# EAGLE schematic Voltage Divider (EAGLE 8.2.1)
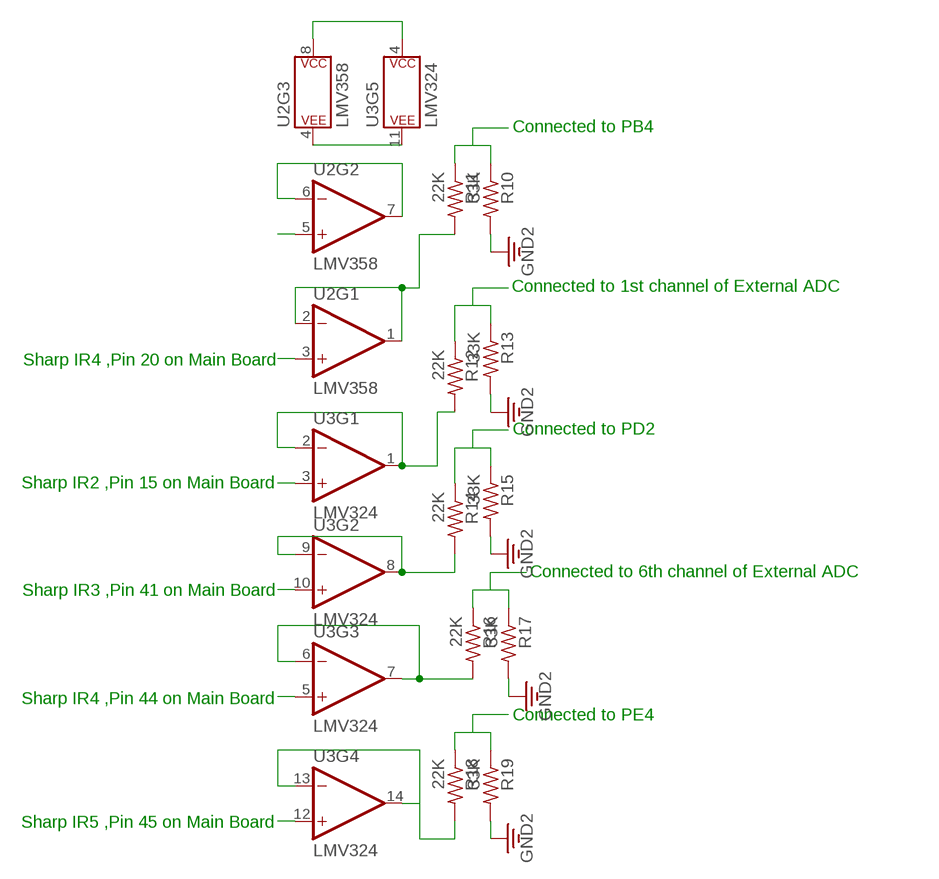
[diagram p0: schematic, sheet 1]

## Parts
R10  33K  R-US_M1206  [M1206]
R11  22K  R-US_M1206  [M1206]
R12  22K  R-US_M1206  [M1206]
R13  33K  R-US_M1206  [M1206]
R14  22K  R-US_M1206  [M1206]
R15  33K  R-US_M1206  [M1206]
R16  22K  R-US_M1206  [M1206]
R17  33K  R-US_M1206  [M1206]
R18  22K  R-US_M1206  [M1206]
R19  33K  R-US_M1206  [M1206]
U2  LMV358  LMV358SOIC  [SO08]
U3  LMV324  [SO14]

## Nets
5V1 [5V1]: U2.8(P$V+) U3.4(P$V+)
11: U2.3(+IN)
15: U3.3(+IN)
41: U3.10(+IN)
44: U3.5(+IN)
45: U3.12(+IN)
EX1: R12.1 R13.1
EX6: R16.1 R17.1
GND [5V1]: R10.2 R13.2 R15.2 R17.2 R19.2 U2.4(P$V-) U3.11(P$V-)
N1: R11.2 U2.1(OUT) U2.2(-IN)
N2: R12.2 U3.1(OUT) U3.2(-IN)
N3: R14.2 U3.8(OUT) U3.9(-IN)
N4: R16.2 U3.6(-IN) U3.7(OUT)
N5: R18.2 U3.13(-IN) U3.14(OUT)
N$2: U2.6(-IN) U2.7(OUT)
NC: U2.5(+IN)
PB4: R10.1 R11.1
PD2: R14.1 R15.1
PE4: R18.1 R19.1

## Notes on the sheet
- Connected to PB4
- Connected to 1st channel of External ADC
- Sharp IR4 ,Pin 20 on Main Board
- Connected to PD2
- Sharp IR2 ,Pin 15 on Main Board
- Connected to 6th channel of External ADC
- Sharp IR3 ,Pin 41 on Main Board
- Sharp IR4 ,Pin 44 on Main Board
- Connected to PE4
- Sharp IR5 ,Pin 45 on Main Board

## Library data of the parts
R10-R19 = adafruit:R-US_: RESISTOR, American symbol
U2 = SparkFun-IC-Amplifiers:LMV358: IC LMV358 DUAL OP AMP Jellybean rail-to-rail output op-amp SparkFun Products SparkFun PicoBoard <https://www.sparkfun.com/products/11888> (WIG-11888) SparkFun Vernier Interface Shield <https://www.sparkfun.com/products/12858> (DEV-12858) SparkFun Blynk Board - ESP8266 <https://www.sparkfun.com/products/13794> (WRL-13794) SparkFun Digital Sandbox <https://www.sparkfun.com/products/12651> (DEV-12651 RoHS); PROD_ID: IC-09657
U3 = SparkFun-IC-Amplifiers:LMV324: IC LMV324 Quad Op Amp Jellybean quad op-amp Datasheet <http://cdn.sparkfun.com/datasheets/Sensors/Sound/LMV324.pdf> SparkFun Products SparkFun Sensor Kit <https://www.sparkfun.com/products/13754> (DEV-13754) SparkFun Inventor's Kit for Arduino 101 <https://www.sparkfun.com/products/13844> (KIT-13844) SparkFun Sound Detector <https://www.sparkfun.com/products/12642> (SEN-12642); PROD_ID: IC-08227

## Net classes
0 default: width 0.2 mm, clearance 0.2 mm
1 5V1: width 1 mm, clearance 0.2 mm